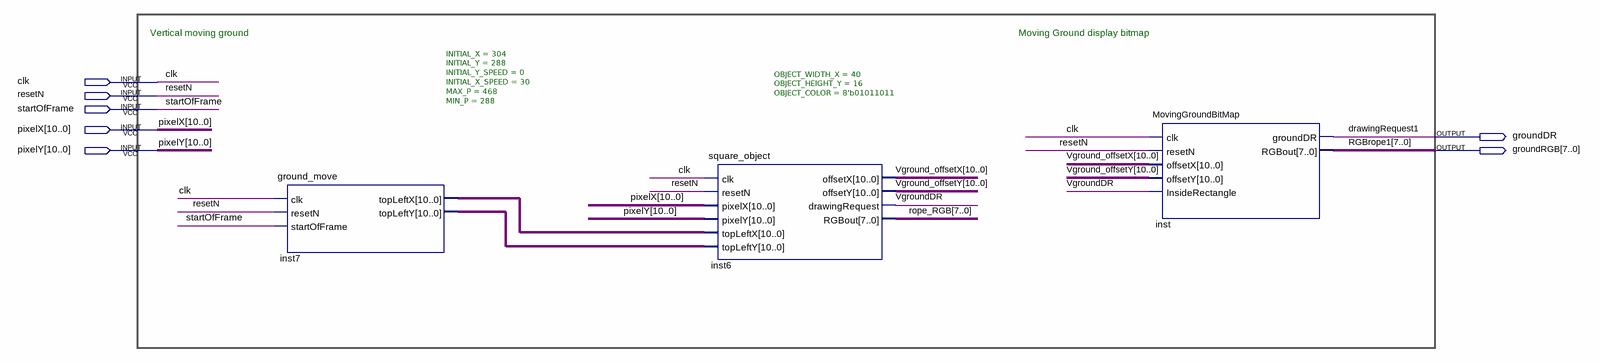
[diagram p0: schematic sheet]
// Quartus schematic Moving_Ground.bdf as structural Verilog: 3 symbols, 7 pins
module Moving_Ground (
  input  clk,
  input  resetN,
  input  startOfFrame,
  input  [10:0] pixelX,
  input  [10:0] pixelY,
  output groundDR,
  output [7:0] groundRGB
);

  wire VgroundDR;
  wire [7:0] rope_RGB;
  wire [10:0] inst7_topleftx, inst7_toplefty, Vground_offsetX, Vground_offsetY;

  ground_move #(.INITIAL_X(304), .INITIAL_Y(288), .INITIAL_Y_SPEED(0), .INITIAL_X_SPEED(30), .MAX_P(468), .MIN_P(288)) inst7 (
    .clk(clk), .resetN(resetN), .startOfFrame(startOfFrame), .topLeftX(inst7_topleftx),
    .topLeftY(inst7_toplefty));
  square_object #(.OBJECT_WIDTH_X(40), .OBJECT_HEIGHT_Y(16), .OBJECT_COLOR(8'b01011011)) inst6 (
    .clk(clk), .resetN(resetN), .pixelX(pixelX), .pixelY(pixelY), .topLeftX(inst7_topleftx),
    .topLeftY(inst7_toplefty), .offsetX(Vground_offsetX), .offsetY(Vground_offsetY),
    .drawingRequest(VgroundDR), .RGBout(rope_RGB));
  MovingGroundBitMap inst (
    .clk(clk), .resetN(resetN), .offsetX(Vground_offsetX), .offsetY(Vground_offsetY),
    .InsideRectangle(VgroundDR), .groundDR(groundDR), .RGBout(groundRGB));

  // Other names for the same wires on the sheet: drawingRequest1 = groundDR; RGBrope1[7:0] = groundRGB

  // Notes on the sheet:
  //   Vertical moving ground
  //   Moving Ground display bitmap
endmodule
